# EAGLE schematic duaghter (EAGLE 6.5.0)
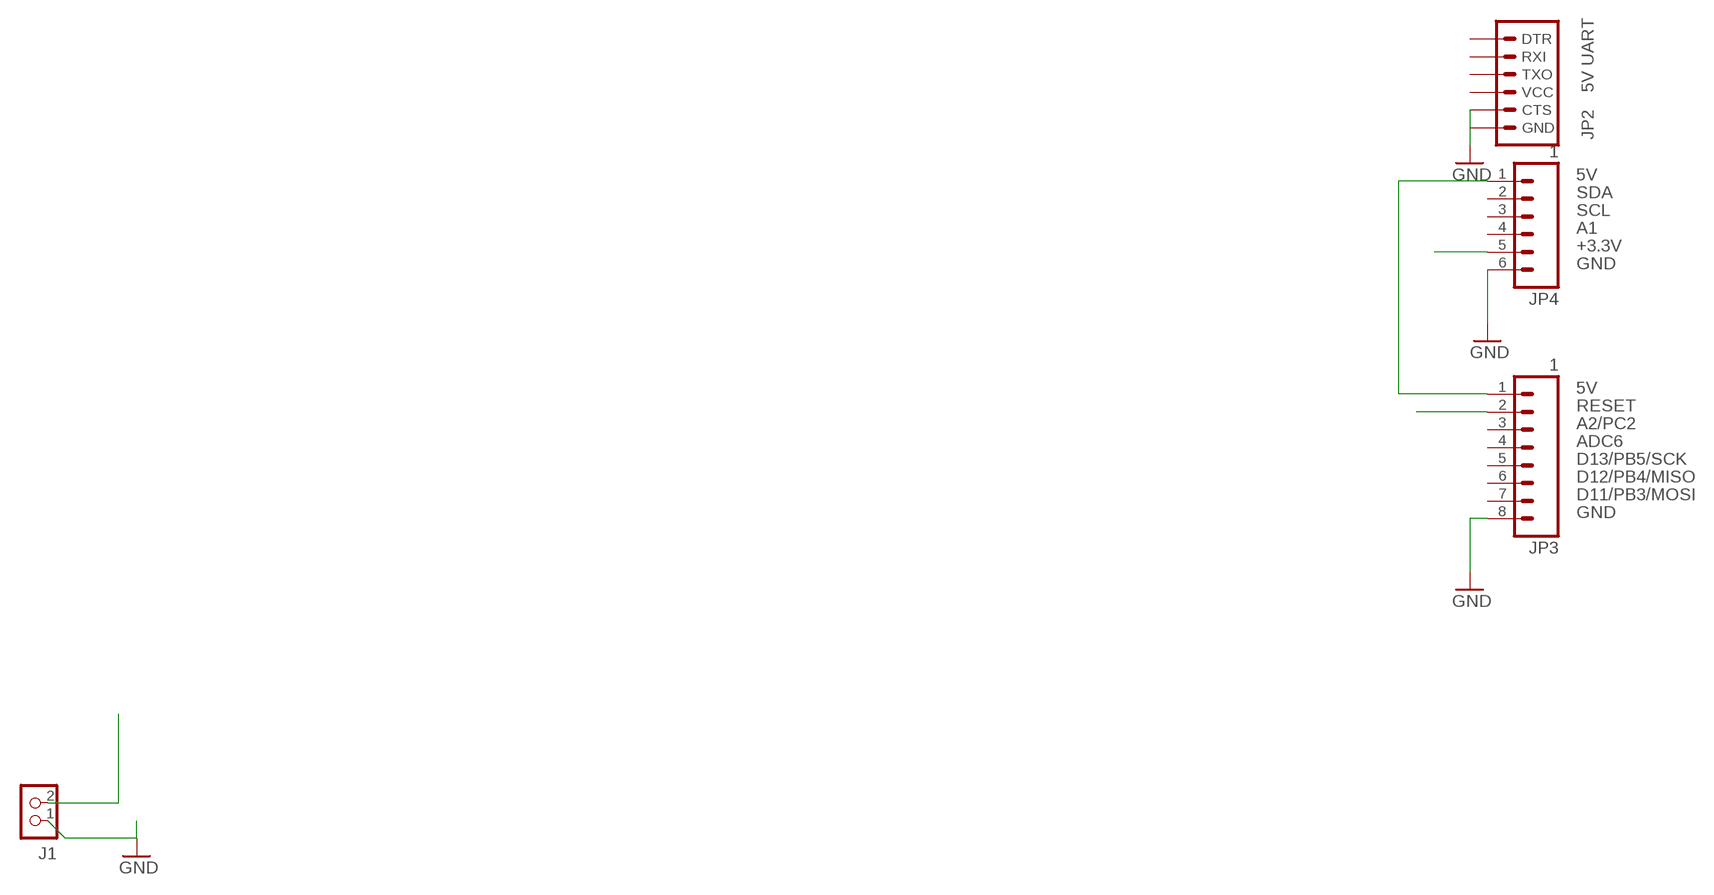
[diagram p0: schematic, sheet 1]

## Parts
J1  12V input  CON_HEADER_1X02-PTH  [M1X2]
JP2  5V UART  ARDUINO_SERIAL_PROGRAMPTH  [1X06]
JP3  1  M081X08  [1X08]
JP4  1  M06SIP  [1X06]

## Nets
+3.3V: JP4.5
+5V: JP3.1 JP4.1
+12V: J1.2
GND: J1.1 JP2.5(CTS) JP2.6(GND) JP3.8 JP4.6
RESET: JP3.2
Unconnected: JP2.1(DTR) JP2.2(RXI) JP2.3(TXO) JP2.4(VCC) JP3.3 JP3.4 JP3.5 JP3.6 JP3.7 JP4.2 JP4.3 JP4.4

## Notes on the sheet
- 5V
- SDA
- SCL
- A1
- GND
- 5V
- A2/PC2
- ADC6
- D13/PB5/SCK
- D12/PB4/MISO
- D11/PB3/MOSI
- GND

## Library data of the parts
J1 = dp_devices:CON_HEADER_1X02
JP2 = SparkFun:ARDUINO_SERIAL_PROGRAM
JP3 = SparkFun-Connectors:M08: Header 8 Standard 8-pin 0.1" header. Use with straight break away headers (SKU : PRT-00116), right angle break away headers (PRT-00553), swiss pins (PRT-00743), machine pins (PRT-00117), and female headers (PRT-00115).
JP4 = SparkFun-Connectors:M06: Header 6 Standard 6-pin 0.1" header. Use with straight break away headers (SKU : PRT-00116), right angle break away headers (PRT-00553), swiss pins (PRT-00743), machine pins (PRT-00117), and female headers (PRT-00115). Molex polarized connector foot print use with SKU : PRT-08094 with associated crimp pins and housings. NOTES ON THE VARIANTS LOCK and LOCK_LONGPADS... This footprint was designed to help hold the alignment of a through-hole component (i.e. 6-pin header) while soldering it into place. You may notice that each hole has been shifted either up or down by 0.005 of an inch from it's more standard position (which is a perfectly straight line). This slight alteration caused the pins (the squares in the middle) to touch the edges of the holes. Because they are alternating, it causes a "brace" to hold the component in place. 0.005 has proven to be the perfect amount of "off-center" position when using our standard breakaway headers. Although looks a little odd when you look at the bare footprint, once you have a header in there, the alteration is very hard to notice. Also, if you push a header all the way into place, it is covered up entirely on the bottom side. This idea of altering the position of holes to aid alignment will be further integrated into the Sparkfun Library for other footprints. It can help hold any component with 3 or more connection pins.

## Net classes
1 vcc: width 0.254 mm